# Altium schematic sheet STM32_Peripherals.SchDoc
size A; SheetNumber: 5; SheetTotal: 8
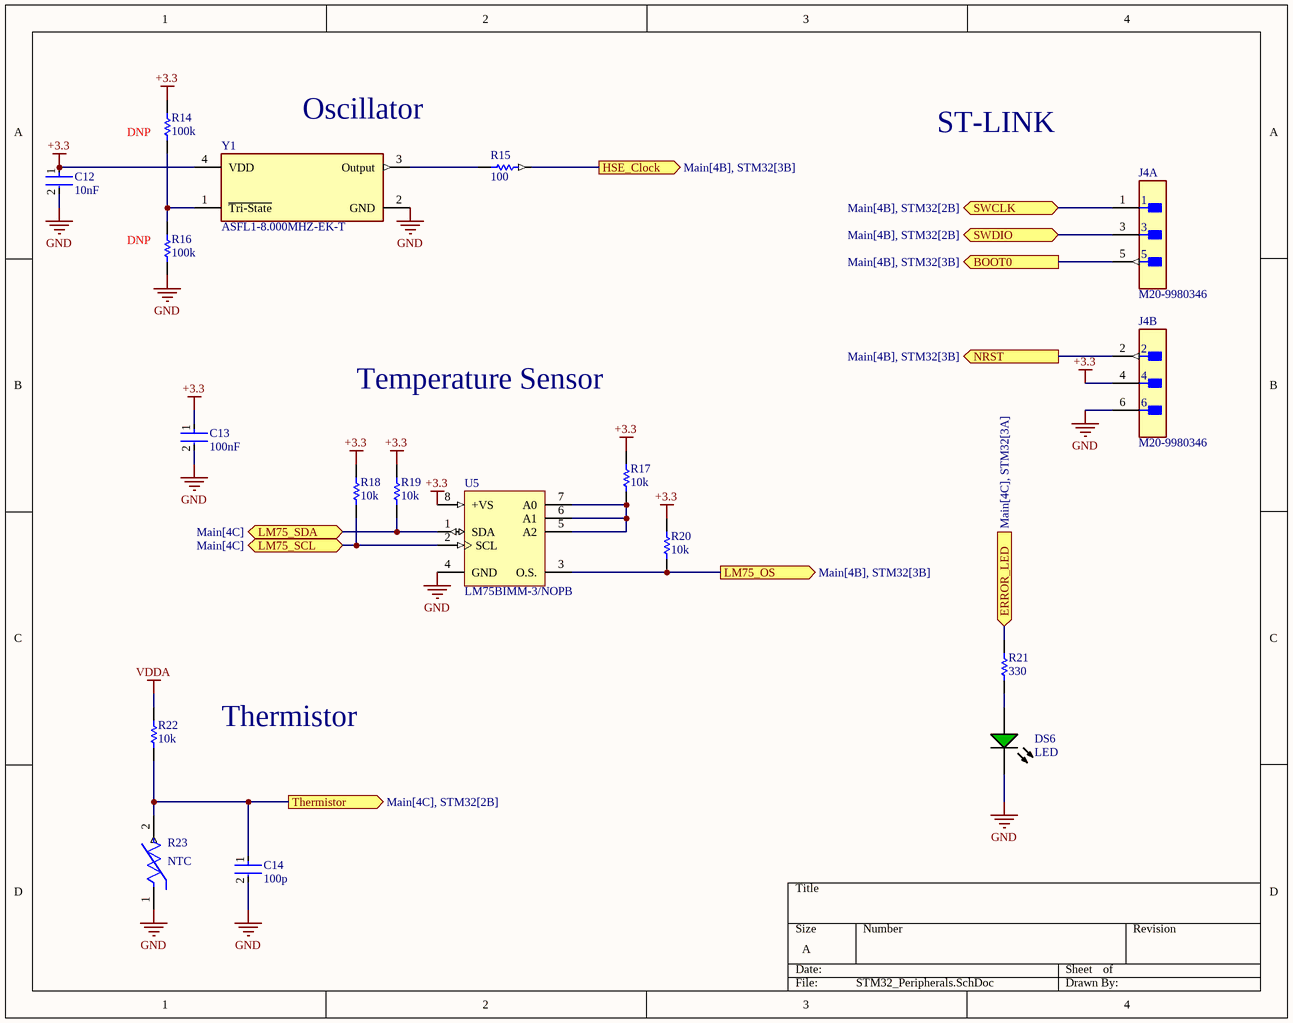
[diagram p0: STM32_Peripherals.SchDoc]

## Parts
C12  10nF  [FP-0805-L_2_01_0_2-W_1_25-IPC_B]
C13  100nF  [FP-0805-L_2_01_0_2-W_1_25-IPC_B]
C14  100p  [FP-0805-L_2_01_0_2-W_1_25-IPC_B]
DS6  LED  [AVAG-HSMX-C170_V]
J4  M20-9980346  [FP-M20-9980346-MFG]  (parts A,B of 2)
R14  100k  [RESC2013X50X30LL20T20]
R15  100  [RESC2013X50X30LL20T20]
R16  100k  [RESC2013X50X30LL20T20]
R17  10k  [RESC2013X50X30LL20T20]
R18  10k  [RESC2013X50X30LL20T20]
R19  10k  [RESC2013X50X30LL20T20]
R20  10k  [RESC2013X50X30LL20T20]
R21  330  [RESC2013X50X30LL20T20]
R22  10k  [RESC2013X50X30LL20T20]
R23  NTC  [FP-NTCALUG02A103G-MFG]
U5  LM75BIMM-3/NOPB  [DGK0008A_L]
Y1  ASFL1-8.000MHZ-EK-T  [FP-ASFL1-MFG]

## Ports
BOOT0 (out, see Main[4B], STM32[3B]), ERROR_LED (in, see Main[4C], STM32[3A]), HSE_Clock (out, see Main[4B], STM32[3B]), LM75_OS (out, see Main[4B], STM32[3B]), LM75_SCL (bidir, see Main[4C]), LM75_SDA (bidir, see Main[4C]), NRST (out, see Main[4B], STM32[3B]), SWCLK (bidir, see Main[4B], STM32[2B]), SWDIO (bidir, see Main[4B], STM32[2B]), Thermistor (out, see Main[4C], STM32[2B])

## Nets
+3.3: C12.1 C13.1 J4.4 R14.2 R17.2 R18.2 R19.2 R20.2 U5.8(+VS) Y1.4(VDD)
GND: C12.2 C13.2 C14.2 DS6.2(K) J4.6 R16.1 R23.1 U5.4(GND) Y1.2(GND)
VDDA: R22.2
BOOT0: J4.5 ; port BOOT0
ERROR_LED: R21.2 ; port ERROR_LED
HSE_Clock: R15.2 ; port HSE_Clock
LM75_OS: R20.1 U5.3(O.S.) ; port LM75_OS
LM75_SCL: R18.1 U5.2(SCL) ; port LM75_SCL
LM75_SDA: R19.1 U5.1(SDA) ; port LM75_SDA
NRST: J4.2 ; port NRST
SWCLK: J4.1 ; port SWCLK
SWDIO: J4.3 ; port SWDIO
Thermistor: C14.1 R22.1 R23.2 ; port Thermistor
NetDS6_1: DS6.1(A) R21.1
NetR14_1: R14.1 R16.2 Y1.1(~{Tri-State})
NetR15_1: R15.1 Y1.3(Output)
NetR17_1: R17.1 U5.5(A2) U5.6(A1) U5.7(A0)

## Notes on the sheet
- (near R14) DNP
- Oscillator
- ST-LINK
- (near R16) DNP
- Temperature Sensor
- Thermistor

## Library data of the parts
C12 = CMP-2007-04174-2: General Purpose Ceramic Capacitor, 0805, 10nF, 10%, X7R, 15%, 100V; Capacitance: 100nF; Packaging: Tape and Reel; Min Operating Temperature: -55°C; Dielectric Material: Ceramic; Height: 1.4mm; Voltage Rating: 100V; Termination: SMD/SMT; Case Code (Imperial): 0805; Case Code (Metric): 2012; Case/Package: 0805; Construction: Flat; Radiation Hardening: No; Series: -; Dielectric: X7R; Package Quantity: 2000; Mount: Surface Mount; Contact Plating: Tin; Voltage: 100V; Lead Free: Lead Free; Depth: 1.25mm; RoHS Compliant: Yes; Number of Pins: 2; Max Operating Temperature: 125°C; Length: 2.01mm; Voltage Rating (DC): 100V; Thickness: 0.055inch; REACH SVHC: No SVHC; Width: 0.049inch; Tolerance: 10%
C13 = CMP-2007-04174-2: General Purpose Ceramic Capacitor, 0805, 100nF, 10%, X7R, 15%, 100V; Packaging: Tape and Reel; Min Operating Temperature: -55°C; Dielectric Material: Ceramic; Height: 1.4mm; Voltage Rating: 100V; Termination: SMD/SMT; Case Code (Imperial): 0805; Case Code (Metric): 2012; Case/Package: 0805; Construction: Flat; Radiation Hardening: No; Series: -; Dielectric: X7R; Package Quantity: 2000; Mount: Surface Mount; Capacitance: 100nF; Contact Plating: Tin; Voltage: 100V; Lead Free: Lead Free; Depth: 1.25mm; RoHS Compliant: Yes; Number of Pins: 2; Max Operating Temperature: 125°C; Length: 2.01mm; Voltage Rating (DC): 100V; Thickness: 0.055inch; REACH SVHC: No SVHC; Width: 0.049inch; Tolerance: 10%
C14 = CMP-2007-04174-2: General Purpose Ceramic Capacitor, 0805, 100pF, 10%, X7R, 15%, 100V; Capacitance: 100nF; Packaging: Tape and Reel; Min Operating Temperature: -55°C; Dielectric Material: Ceramic; Height: 1.4mm; Voltage Rating: 100V; Termination: SMD/SMT; Case Code (Imperial): 0805; Case Code (Metric): 2012; Case/Package: 0805; Construction: Flat; Radiation Hardening: No; Series: -; Dielectric: X7R; Package Quantity: 2000; Mount: Surface Mount; Contact Plating: Tin; Voltage: 100V; Lead Free: Lead Free; Depth: 1.25mm; RoHS Compliant: Yes; Number of Pins: 2; Max Operating Temperature: 125°C; Length: 2.01mm; Voltage Rating (DC): 100V; Thickness: 0.055inch; REACH SVHC: No SVHC; Width: 0.049inch; Tolerance: 10%
DS6 = CMP-2000-05062-1: Chip LED, Green, 2.2 V, -40 to 85 degC, 2-Pin SMD, Pb-Free, Tape and Reel; Manufacturer: Avago; No. of Pins: 2; Peak Wavelength: 570nm; SVHC: NoSVHC(16-Jun-2014); Dominant Wavelength: 572nm; Forward Current If: 20mA; Viewing Angle: 170deg; Lens Shape: Rectangular; PIV Max: 5V; External Width: 1.25mm; LED Type: Standard; External Depth: 0.8mm; Opto Mounting Orientation: Top; Luminous Intensity: 15mcd; Luminous Intensity Min: 4mcd; Forward Voltage VF Max: 2.6V; External Length / Height: 2mm; Bulb Size: 1.25mmx1.4mm; Light Area Height: 1mm; Voltage Vf Typ: 2.2V; Operating Temperature Max: 85degC; Datasheet Version: Oct-08; MSL: MSL2A-4weeks; Peak Forward Current: 20mA; Package Description: 2-Pin Surface Mount Device, Body 2 x 1.25 mm, Height 0.8 mm; Datasheet URL: https://datasheet.ciiva.com/29280/180495-da-01-en-chip-led-hsmg-c170-gelb-gruen-29280971.pdf; Storage Temperature Min: -40degC; LED Colour: Green; Wavelength Typ: 570nm; Mounting Type: SMD; Forward Current If Max: 20mA; Dominant Wavelength Typ: 572nm; LED Mounting: SMD; Operating Temperature Range: -30degCto+85degC; Operating Temperature Min: -30degC; Manufacturer URL: http://www.avagotech.com/; Packaging: CutTape; Luminous Intensity Typ: 15mcd; Package Reference: HSMX-C170; Storage Temperature Max: 85degC; Opto Case Style: SMD; Forward Voltage: 2.2V
J4 = CMP-2000-06636-2: CONN HEADER VERT 6POS 2.54MM; Manufacturer: Harwin; Current Rating: 3A; Number Of Contacts: 6; Conn Gender: Male; Conn Orientation: Vertical; Device Class L1: Connectors; ComponentLink2Description: Datasheet; Height: 8.99mm; Temperature Range High: +105°C; Contact Material: Tin,Nickel; RoHS: TRUE; Temperature Range Low: -40°C; ComponentLink2URL: https://cdn.harwin.com/pdfs/M20-998.pdf; Digikey Description: CONN HEADER VERT 6POS 2.54MM; Pitch: 2.54mm; Package: M20-9980346; Device Class L2: Headers and Wire Housings; Manufacturer Part Number: M20-9980346; Number Of Rows: 2; Category: Conn; Lead Free: Yes; Mouser Description: 2.54mm (0.1") Pitch DIL Vertical PC Tail Pin Header, 6.1mm mating pin height, tin, 3+3 contacts; Temperature: -40°C to +105°C; Device Class L3: unset; Octopart: https://octopart.com/m20-9980346-harwin-5436545; Automotive: No
R14-R22 = CMP-2001-04896-1: Manufacturer: Vishay Dale; Part Number: CRCW08050000Z0EA
R23 = CMP-02404-000019-1: THERM NTC 10KOHM 3984K RING LUG; Max Power Dissipation: 100mW; Accuracy: 0.5%; Resistance: 10kR; Tolerance: 2%; Radiation Hardening: No; Depth: 4.1mm; Contact Plating: Tin; Length: 8.5mm; RoHS Compliant: Yes; Resistance Tolerance: 2%; Packaging: Bulk; Mount: Free Hanging; Termination: Wire; Package Quantity: 500; Max Operating Temperature: 125°C; Series: Automotive, AEC-Q200, NTCA; Number of Pins: 2; Min Operating Temperature: -55°C
U5 = CMP-0066-00336-3: Digital Temperature Sensor and Thermal Watchdog with Two-Wire Interface, 8-pin Mini SOIC, Pb-Free; Manufacturer: Texas Instruments; CompType: Temp Sensor IC; PackageTopMarking: ZXTT*T01B; PowerWise: N; RoHS: Y; ComponentLink1URL: http://www.ti.com/general/docs/lit/getliterature.tsp?genericPartNumber=LM75B&fileType=pdf; PackageDescription: MINI SOIC, .118 x .118 x .034in, 8 Lead, .0256in Pitch; Code_JEDEC: MO-187-AA; PinCount: 8; ComponentLink1Description: Datasheet URL; PackageReference: DGK0008A
Y1 = CMP-27762-013261-1: XTAL Oscillator 8MHz ±30ppm HCMOS, TTL 3.3V 4-SMD 5mm x 3.2mm; Min Supply Voltage: 2.97V; Load Capacitance: 15pF; Max Supply Voltage: 3.63V; Max Supply Current: 15mA; Radiation Hardening: No; Termination: SMD/SMT; Max Operating Temperature: 70°C; Frequency Stability: 30ppm; Series: ASFL1; Package Quantity: 1000; Mount: Surface Mount; Packaging: Tape and Reel; Length: 5mm; Case/Package: SMD/SMT; Lead Free: Lead Free; Operating Supply Voltage: 3.3V; Height: 0.051inch; Frequency: 8MHz; Number of Pins: 4; Depth: 3.2mm; Operating Frequency: 8 MHz; Width: 0.126inch; Min Operating Temperature: -20°C